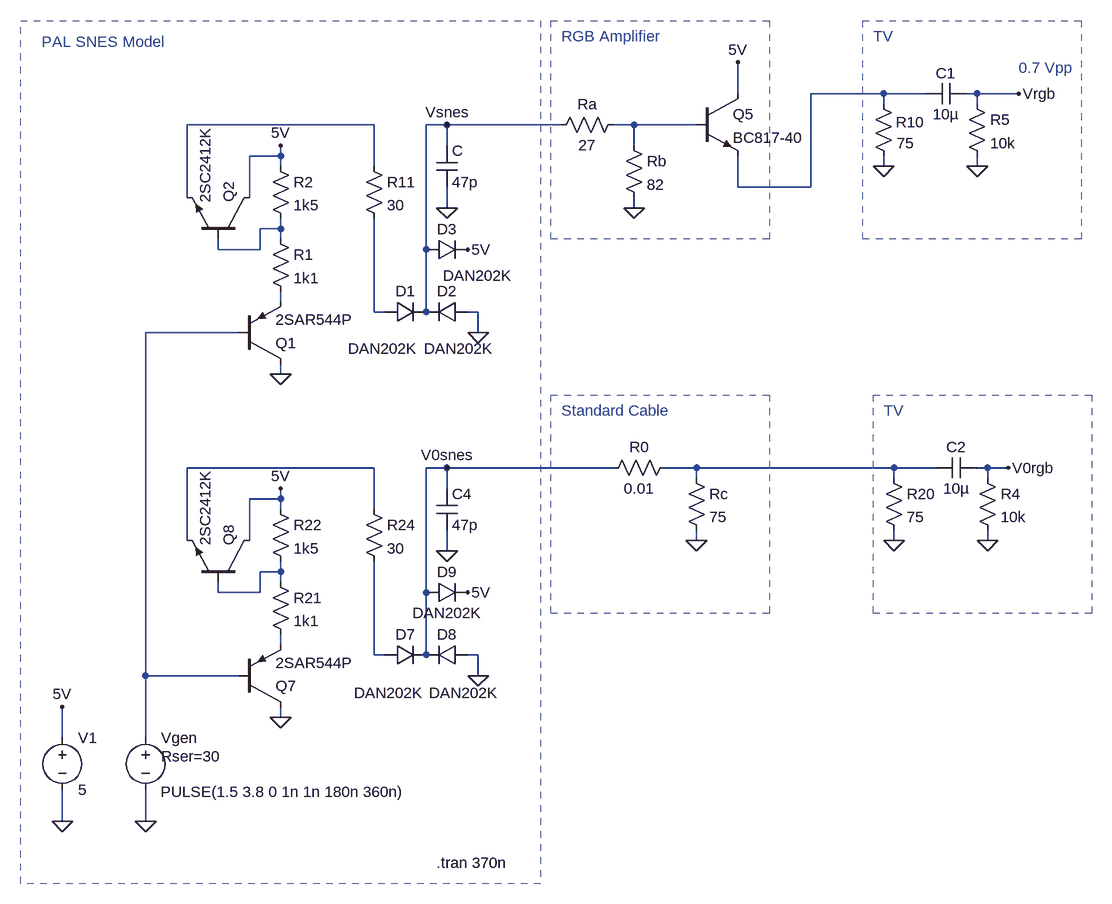
[diagram p0: schematic PAL_SNES_RGB_Amp_v1.asc]
PAL_SNES_RGB_Amp_v1.asc, the LTspice schematic file:
Version 4
SHEET 1 2552 1460
WIRE 720 240 720 192
WIRE 944 240 832 240
WIRE 1008 240 944 240
WIRE 1088 240 1072 240
WIRE 1152 240 1088 240
WIRE 944 256 944 240
WIRE 1088 256 1088 240
WIRE 160 288 -128 288
WIRE 272 288 240 288
WIRE 448 288 272 288
WIRE 560 288 528 288
WIRE 656 288 560 288
WIRE 272 320 272 288
WIRE 560 320 560 288
WIRE 16 336 16 320
WIRE 16 336 -32 336
WIRE 16 352 16 336
WIRE 160 352 160 288
WIRE 944 352 944 336
WIRE 1088 352 1088 336
WIRE 720 384 720 336
WIRE 832 384 832 240
WIRE 832 384 720 384
WIRE -128 400 -128 288
WIRE -32 400 -32 336
WIRE 272 416 272 384
WIRE 560 416 560 400
WIRE 16 448 16 432
WIRE 16 448 -16 448
WIRE 16 464 16 448
WIRE -80 480 -80 464
WIRE -16 480 -16 448
WIRE -16 480 -80 480
WIRE 240 480 240 288
WIRE 16 560 16 544
WIRE 160 576 160 432
WIRE 176 576 160 576
WIRE 240 576 240 480
WIRE 320 576 304 576
WIRE -48 608 -192 608
WIRE 320 608 320 576
WIRE 16 672 16 656
WIRE 160 816 -128 816
WIRE 272 816 240 816
WIRE 528 816 272 816
WIRE 656 816 608 816
WIRE 960 816 656 816
WIRE 1024 816 960 816
WIRE 1104 816 1088 816
WIRE 1136 816 1104 816
WIRE 656 832 656 816
WIRE 960 832 960 816
WIRE 1104 832 1104 816
WIRE 272 848 272 816
WIRE 16 864 16 848
WIRE 16 864 -32 864
WIRE 16 880 16 864
WIRE 160 880 160 816
WIRE -128 928 -128 816
WIRE -32 928 -32 864
WIRE 656 928 656 912
WIRE 960 928 960 912
WIRE 1104 928 1104 912
WIRE 272 944 272 912
WIRE 16 976 16 960
WIRE 16 976 -16 976
WIRE 16 992 16 976
WIRE -80 1008 -80 992
WIRE -16 1008 -16 976
WIRE -16 1008 -80 1008
WIRE 240 1008 240 816
WIRE 16 1088 16 1072
WIRE 160 1104 160 960
WIRE 176 1104 160 1104
WIRE 240 1104 240 1008
WIRE 320 1104 304 1104
WIRE -192 1136 -192 608
WIRE -48 1136 -192 1136
WIRE 320 1136 320 1104
WIRE 16 1200 16 1184
WIRE -320 1232 -320 1184
WIRE -192 1232 -192 1136
WIRE -320 1360 -320 1312
WIRE -192 1360 -192 1312
FLAG 304 480 5V
FLAG 320 608 0
FLAG 272 416 0
FLAG 16 672 0
FLAG 16 320 5V
FLAG -320 1360 0
FLAG -320 1184 5V
FLAG 560 416 0
FLAG 272 288 Vsnes
FLAG 944 352 0
FLAG 720 192 5V
FLAG 1152 240 Vrgb
FLAG 1136 816 V0rgb
FLAG 960 928 0
FLAG 304 1008 5V
FLAG 320 1136 0
FLAG 272 944 0
FLAG 16 1200 0
FLAG 16 848 5V
FLAG -192 1360 0
FLAG 272 816 V0snes
FLAG 656 928 0
FLAG 1104 928 0
FLAG 1088 352 0
SYMBOL diode 176 592 R270
WINDOW 0 32 32 VTop 2
WINDOW 3 -25 -3 VBottom 2
SYMATTR InstName D1
SYMATTR Value DAN202K
SYMBOL diode 304 560 R90
WINDOW 0 0 32 VBottom 2
WINDOW 3 57 14 VTop 2
SYMATTR InstName D2
SYMATTR Value DAN202K
SYMBOL diode 240 496 R270
WINDOW 0 32 32 VTop 2
WINDOW 3 -9 79 VBottom 2
SYMATTR InstName D3
SYMATTR Value DAN202K
SYMBOL cap 256 320 R0
SYMATTR InstName C
SYMATTR Value 47p
SYMBOL pnp -48 656 M180
SYMATTR InstName Q1
SYMATTR Value 2SAR544P
SYMBOL npn -32 464 M270
SYMATTR InstName Q2
SYMATTR Value 2SC2412K
SYMBOL res 0 448 R0
SYMATTR InstName R1
SYMATTR Value 1k1
SYMBOL res 0 336 R0
SYMATTR InstName R2
SYMATTR Value 1k5
SYMBOL voltage -320 1216 R0
WINDOW 123 0 0 Left 0
WINDOW 39 24 44 Left 2
SYMATTR InstName V1
SYMATTR Value 5
SYMBOL res 144 336 R0
SYMATTR InstName R11
SYMATTR Value 30
SYMBOL res 928 240 R0
WINDOW 0 35 44 Left 2
SYMATTR InstName R10
SYMATTR Value 75
SYMBOL res 432 304 R270
WINDOW 0 32 56 VTop 2
WINDOW 3 0 56 VBottom 2
SYMATTR InstName Ra
SYMATTR Value 27
SYMBOL npn 656 240 R0
SYMATTR InstName Q5
SYMATTR Value BC817-40
SYMBOL res 544 304 R0
SYMATTR InstName Rb
SYMATTR Value 82
SYMBOL res 944 816 R0
SYMATTR InstName R20
SYMATTR Value 75
SYMBOL diode 176 1120 R270
WINDOW 0 32 32 VTop 2
WINDOW 3 -27 6 VBottom 2
SYMATTR InstName D7
SYMATTR Value DAN202K
SYMBOL diode 304 1088 R90
WINDOW 0 0 32 VBottom 2
WINDOW 3 59 6 VTop 2
SYMATTR InstName D8
SYMATTR Value DAN202K
SYMBOL diode 240 1024 R270
WINDOW 0 32 32 VTop 2
WINDOW 3 0 32 VBottom 2
SYMATTR InstName D9
SYMATTR Value DAN202K
SYMBOL cap 256 848 R0
SYMATTR InstName C4
SYMATTR Value 47p
SYMBOL pnp -48 1184 M180
SYMATTR InstName Q7
SYMATTR Value 2SAR544P
SYMBOL npn -32 992 M270
SYMATTR InstName Q8
SYMATTR Value 2SC2412K
SYMBOL res 0 976 R0
SYMATTR InstName R21
SYMATTR Value 1k1
SYMBOL res 0 864 R0
SYMATTR InstName R22
SYMATTR Value 1k5
SYMBOL voltage -192 1216 R0
WINDOW 3 23 99 Left 2
WINDOW 123 24 124 Left 2
WINDOW 39 24 44 Left 2
SYMATTR Value PULSE(1.5 3.8 0 1n 1n 180n 360n)
SYMATTR SpiceLine Rser=30
SYMATTR InstName Vgen
SYMBOL res 144 864 R0
SYMATTR InstName R24
SYMATTR Value 30
SYMBOL res 512 832 R270
WINDOW 0 32 56 VTop 2
WINDOW 3 0 56 VBottom 2
SYMATTR InstName R0
SYMATTR Value 0.01
SYMBOL res 640 816 R0
SYMATTR InstName Rc
SYMATTR Value 75
SYMBOL cap 1072 224 R90
WINDOW 0 0 32 VBottom 2
WINDOW 3 32 32 VTop 2
SYMATTR InstName C1
SYMATTR Value 10µ
SYMBOL cap 1088 800 R90
WINDOW 0 0 32 VBottom 2
WINDOW 3 32 32 VTop 2
SYMATTR InstName C2
SYMATTR Value 10µ
SYMBOL res 1088 816 R0
SYMATTR InstName R4
SYMATTR Value 10k
SYMBOL res 1072 240 R0
SYMATTR InstName R5
SYMATTR Value 10k
TEXT 256 1424 Left 2 !.tran 370n
TEXT 1152 200 Left 2 ;0.7 Vpp
TEXT -352 160 Left 2 ;PAL SNES Model
TEXT 448 152 Left 2 ;RGB Amplifier
TEXT 448 728 Left 2 ;Standard Cable
TEXT 928 152 Left 2 ;TV
TEXT 944 728 Left 2 ;TV
RECTANGLE Normal 416 1456 -384 128 2
RECTANGLE Normal 432 128 768 464 2
RECTANGLE Normal 432 704 768 1040 2
RECTANGLE Normal 912 128 1248 464 2
RECTANGLE Normal 928 704 1264 1040 2

The netlist it stands for:
* PAL_SNES_RGB_Amp_v1.asc
D1 N006 Vsnes DAN202K
D2 0 Vsnes DAN202K
D3 Vsnes 5V DAN202K
C Vsnes 0 47p
Q1 0 N007 N005 0 2SAR544P
Q2 5V N004 N002 0 2SC2412K
R1 N004 N005 1k1
R2 5V N004 1k5
V1 5V 0 5
R11 N002 N006 30
R10 N001 0 75
Ra Vsnes N003 27
Q5 5V N003 N001 0 BC817-40
Rb N003 0 82
R20 N009 0 75
D7 N012 V0snes DAN202K
D8 0 V0snes DAN202K
D9 V0snes 5V DAN202K
C4 V0snes 0 47p
Q7 0 N007 N011 0 2SAR544P
Q8 5V N010 N008 0 2SC2412K
R21 N010 N011 1k1
R22 5V N010 1k5
Vgen N007 0 PULSE(1.5 3.8 0 1n 1n 180n 360n) Rser=30
R24 N008 N012 30
R0 V0snes N009 0.01
Rc N009 0 75
C1 Vrgb N001 10µ
C2 V0rgb N009 10µ
R4 V0rgb 0 10k
R5 Vrgb 0 10k
.model D D
.lib standard.dio
.model NPN NPN
.model PNP PNP
.lib standard.bjt
.tran 370n
* 0.7 Vpp
* PAL SNES Model
* RGB Amplifier
* Standard Cable
* TV
* TV
.backanno
.end